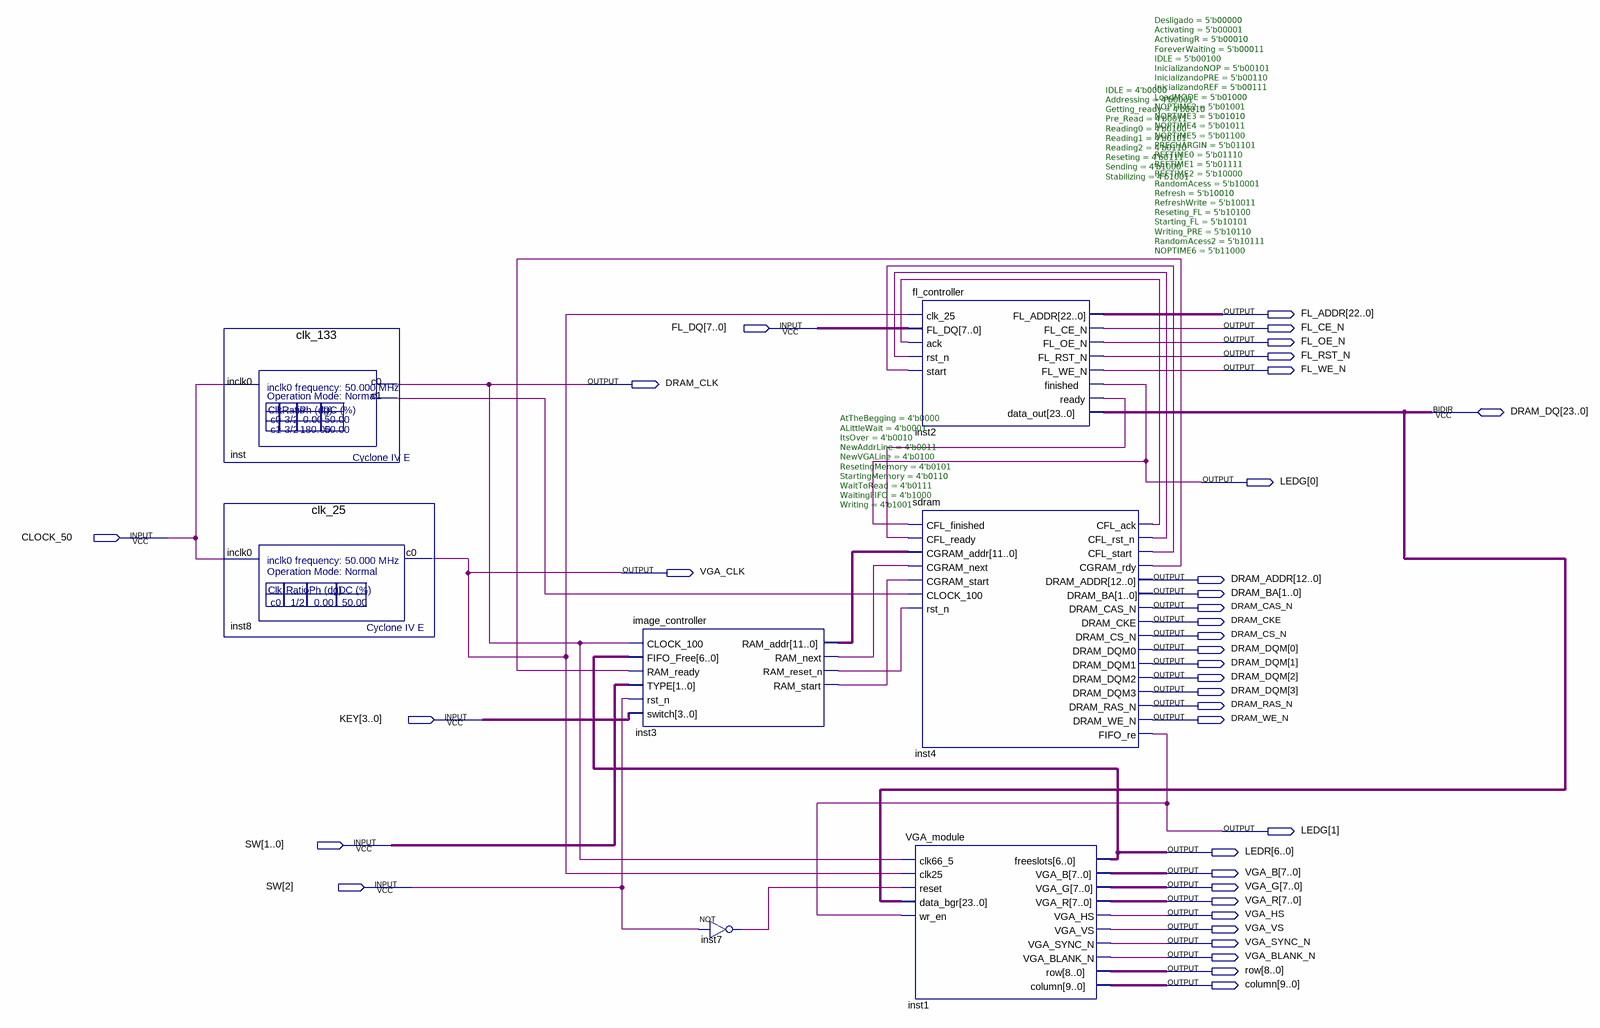
[diagram p0: schematic sheet]
// Quartus schematic LAB4.bdf as structural Verilog: 7 symbols, 36 pins
module LAB4 (
  input  [7:0] FL_DQ,
  input  CLOCK_50,
  input  [3:0] KEY,
  input  [2:0] SW,
  inout  [23:0] DRAM_DQ,
  output [22:0] FL_ADDR,
  output FL_CE_N,
  output FL_OE_N,
  output FL_RST_N,
  output FL_WE_N,
  output DRAM_CLK,
  output [1:0] LEDG,
  output VGA_CLK,
  output [12:0] DRAM_ADDR,
  output [1:0] DRAM_BA,
  output DRAM_CAS_N,
  output DRAM_CKE,
  output DRAM_CS_N,
  output [3:0] DRAM_DQM,
  output DRAM_RAS_N,
  output DRAM_WE_N,
  output [6:0] LEDR,
  output [7:0] VGA_B,
  output [7:0] VGA_G,
  output [7:0] VGA_R,
  output VGA_HS,
  output VGA_VS,
  output VGA_SYNC_N,
  output VGA_BLANK_N,
  output [8:0] row,
  output [9:0] column
);

  wire inst2_ready, inst3_ram_next, inst3_ram_reset_n, inst3_ram_start, inst4_cfl_ack, inst4_cfl_rst_n,
       inst4_cfl_start, inst4_cgram_rdy, inst7_out, inst_c1;
  wire [11:0] inst3_ram_addr;

  clk_133 inst (.inclk0(CLOCK_50), .c0(DRAM_CLK), .c1(inst_c1));
  clk_25 inst8 (.inclk0(CLOCK_50), .c0(VGA_CLK));
  image_controller #(.AtTheBegging(4'b0000), .ALittleWait(4'b0001), .ItsOver(4'b0010), .NewAddrLine(4'b0011), .NewVGALine(4'b0100), .ResetingMemory(4'b0101), .StartingMemory(4'b0110), .WaitToRead(4'b0111), .WaitingFIFO(4'b1000), .Writing(4'b1001)) inst3 (
    .CLOCK_100(DRAM_CLK), .FIFO_Free(LEDR), .RAM_ready(inst4_cgram_rdy), .TYPE(SW[1:0]), .rst_n(SW[2]),
    .switch(KEY), .RAM_addr(inst3_ram_addr), .RAM_next(inst3_ram_next), .RAM_reset_n(inst3_ram_reset_n),
    .RAM_start(inst3_ram_start));
  not inst7 (inst7_out, SW[2]);
  fl_controller #(.IDLE(4'b0000), .Addressing(4'b0001), .Getting_ready(4'b0010), .Pre_Read(4'b0011), .Reading0(4'b0100), .Reading1(4'b0101), .Reading2(4'b0110), .Reseting(4'b0111), .Sending(4'b1000), .Stabilizing(4'b1001)) inst2 (
    .clk_25(VGA_CLK), .FL_DQ(FL_DQ), .ack(inst4_cfl_ack), .rst_n(inst4_cfl_rst_n), .start(inst4_cfl_start),
    .FL_ADDR(FL_ADDR), .FL_CE_N(FL_CE_N), .FL_OE_N(FL_OE_N), .FL_RST_N(FL_RST_N), .FL_WE_N(FL_WE_N),
    .finished(LEDG[0]), .ready(inst2_ready), .data_out(DRAM_DQ));
  sdram #(.Desligado(5'b00000), .Activating(5'b00001), .ActivatingR(5'b00010), .ForeverWaiting(5'b00011), .IDLE(5'b00100), .InicializandoNOP(5'b00101), .InicializandoPRE(5'b00110), .InicializandoREF(5'b00111), .LoadMODE(5'b01000), .NOPTIME2(5'b01001), .NOPTIME3(5'b01010), .NOPTIME4(5'b01011), .NOPTIME5(5'b01100), .PRECHARGIN(5'b01101), .REFTIME0(5'b01110), .REFTIME1(5'b01111), .REFTIME2(5'b10000), .RandomAcess(5'b10001), .Refresh(5'b10010), .RefreshWrite(5'b10011), .Reseting_FL(5'b10100), .Starting_FL(5'b10101), .Writing_PRE(5'b10110), .RandomAcess2(5'b10111), .NOPTIME6(5'b11000)) inst4 (
    .CFL_finished(LEDG[0]), .CFL_ready(inst2_ready), .CGRAM_addr(inst3_ram_addr),
    .CGRAM_next(inst3_ram_next), .CGRAM_start(inst3_ram_start), .CLOCK_100(inst_c1),
    .rst_n(inst3_ram_reset_n), .CFL_ack(inst4_cfl_ack), .CFL_rst_n(inst4_cfl_rst_n),
    .CFL_start(inst4_cfl_start), .CGRAM_rdy(inst4_cgram_rdy), .DRAM_ADDR(DRAM_ADDR), .DRAM_BA(DRAM_BA),
    .DRAM_CAS_N(DRAM_CAS_N), .DRAM_CKE(DRAM_CKE), .DRAM_CS_N(DRAM_CS_N), .DRAM_DQM0(DRAM_DQM[0]),
    .DRAM_DQM1(DRAM_DQM[1]), .DRAM_DQM2(DRAM_DQM[2]), .DRAM_DQM3(DRAM_DQM[3]), .DRAM_RAS_N(DRAM_RAS_N),
    .DRAM_WE_N(DRAM_WE_N), .FIFO_re(LEDG[1]));
  VGA_module inst1 (
    .clk66_5(DRAM_CLK), .clk25(VGA_CLK), .reset(inst7_out), .data_bgr(DRAM_DQ), .wr_en(LEDG[1]),
    .freeslots(LEDR), .VGA_B(VGA_B), .VGA_G(VGA_G), .VGA_R(VGA_R), .VGA_HS(VGA_HS), .VGA_VS(VGA_VS),
    .VGA_SYNC_N(VGA_SYNC_N), .VGA_BLANK_N(VGA_BLANK_N), .row(row), .column(column));
endmodule
